# EAGLE design Testplatine_01_wiebeauftragt (EAGLE 6.5.0)
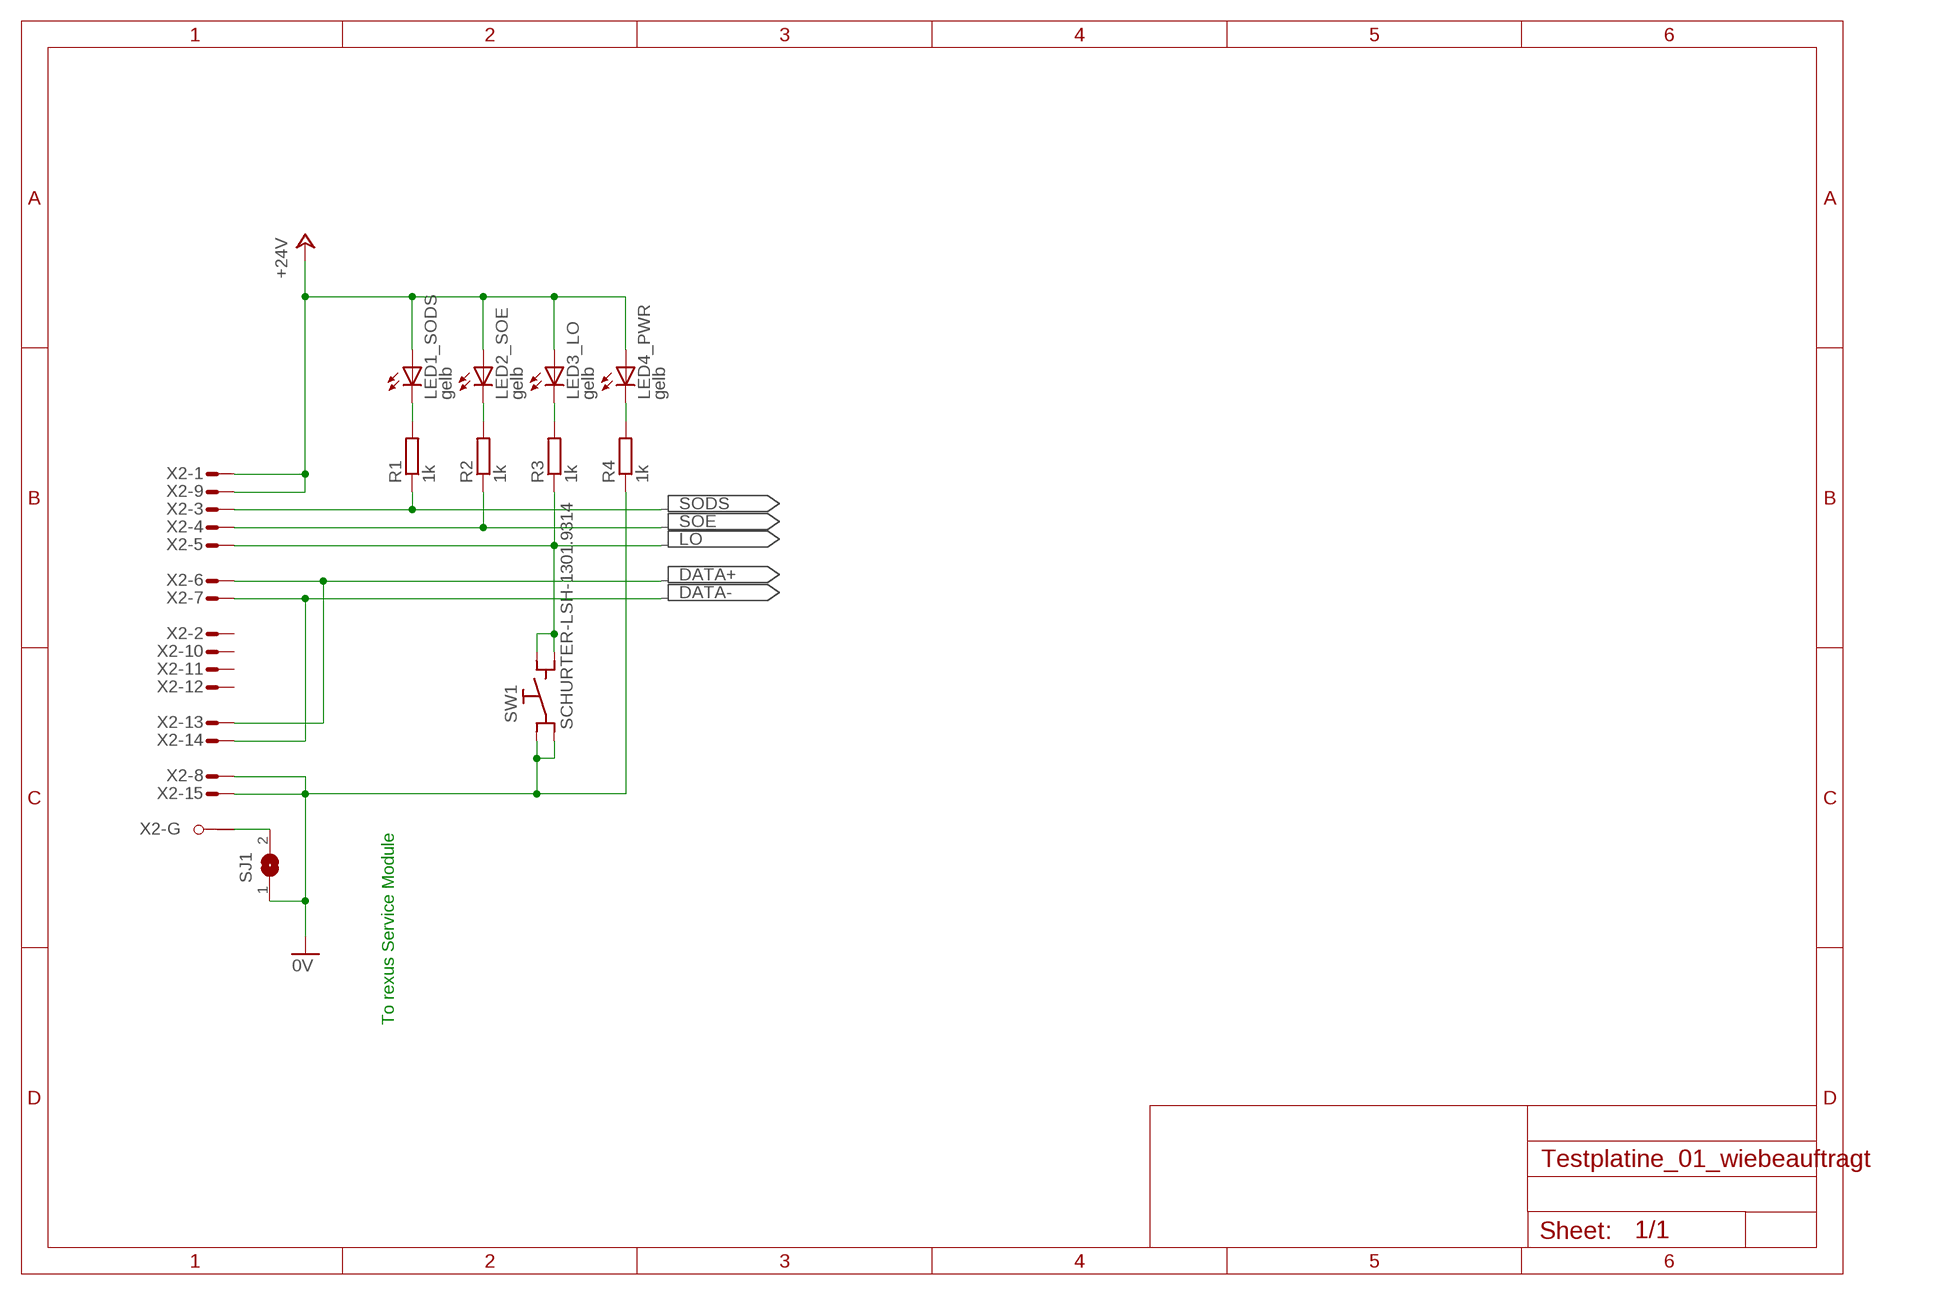
[diagram p0: schematic, sheet 1]

## Parts
LED1_SODS  gelb  LEDCHIPLED_0805  [CHIPLED_0805]
LED2_SOE  gelb  LEDCHIPLED_0805  [CHIPLED_0805]
LED3_LO  gelb  LEDCHIPLED_0805  [CHIPLED_0805]
LED4_PWR  gelb  LEDCHIPLED_0805  [CHIPLED_0805]
R1  1k  R-EU_R0805  [R0805]
R2  1k  R-EU_R0805  [R0805]
R3  1k  R-EU_R0805  [R0805]
R4  1k  R-EU_R0805  [R0805]
SJ1  SJ  [SJ]
SW1  SCHURTER-LSH-1301.9314  [LSH]
X2  M15HPS  [M15HP]

## Nets
0V: R4.1 SJ1.1 SW1.C1(C) SW1.C2(C) X2.8(-8:M) X2.15(-15:M)
+24V: LED1_SODS.A LED2_SOE.A LED3_LO.A LED4_PWR.A X2.1(-1:M) X2.9(-9:M)
DATA+: X2.6(-6:M) X2.13(-13:M)
DATA-: X2.7(-7:M) X2.14(-14:M)
LO: R3.1 SW1.NO1(NO) SW1.NO2(NO) X2.5(-5:M)
N$1: LED1_SODS.C R1.2
N$2: LED2_SOE.C R2.2
N$3: LED3_LO.C R3.2
N$4: LED4_PWR.C R4.2
N$6: SJ1.2 X2.G1(-G:G1)
SODS: R1.1 X2.3(-3:M)
SOE: R2.1 X2.4(-4:M)
Unconnected: X2.2(-2:M) X2.10(-10:M) X2.11(-11:M) X2.12(-12:M) X2.G2(-G:G2)

## Notes on the sheet
- To rexus Service Module

## Library data of the parts
LED1_SODS LED2_SOE LED3_LO LED4_PWR = led:LED: LED OSRAM: - CHIPLED LG R971, LG N971, LY N971, LG Q971, LY Q971, LO R971, LY R971 LH N974, LH R974 LS Q976, LO Q976, LY Q976 LO Q996 - Hyper CHIPLED LW Q18S LB Q993, LB Q99A, LB R99A - SideLED LS A670, LO A670, LY A670, LG A670, LP A670 LB A673, LV A673, LT A673, LW A673 LH A674 LY A675 LS A676, LA A676, LO A676, LY A676, LW A676 LS A679, LY A679, LG A679 - Hyper Micro SIDELED® LS Y876, LA Y876, LO Y876, LY Y876 LT Y87S - SmartLED LW L88C, LW L88S LB L89C, LB L89S, LG L890 LS L89K, LO L89K, LY L89K LS L896, LA L896, LO L896, LY L896 - TOPLED LS T670, LO T670, LY T670, LG T670, LP T670 LSG T670, LSP T670, LSY T670, LOP T670, LYG T670 LG T671, LOG T671, LSG T671 LB T673, LV T673, LT T673, LW T673 LH T674 LS T676, LA T676, LO T676, LY T676, LB T676, LH T676, LSB T676, LW T676 LB T67C, LV T67C, LT T67C, LS T67K, LO T67K, LY T67K, LW E67C LS E67B, LA E67B, LO E67B, LY E67B, LB E67C, LV E67C, LT E67C LW T67C LS T679, LY T679, LG T679 LS T770, LO T770, LY T770, LG T770, LP T770 LB T773, LV T773, LT T773, LW T773 LH T774 LS E675, LA E675, LY E675, LS T675 LS T776, LA T776, LO T776, LY T776, LB T776 LHGB T686 LT T68C, LB T68C - Hyper Mini TOPLED® LB M676 - Mini TOPLED Santana® LG M470 LS M47K, LO M47K, LY M47K Source: http://www.osram.convergy.de LUXEON: - LUMILED® LXK2-PW12-R00, LXK2-PW12-S00, LXK2-PW14-U00, LXK2-PW14-V00 LXK2-PM12-R00, LXK2-PM12-S00, LXK2-PM14-U00 LXK2-PE12-Q00, LXK2-PE12-R00, LXK2-PE12-S00, LXK2-PE14-T00, LXK2-PE14-U00 LXK2-PB12-K00, LXK2-PB12-L00, LXK2-PB12-M00, LXK2-PB14-N00, LXK2-PB14-P00, LXK2-PB14-Q00 LXK2-PR12-L00, LXK2-PR12-M00, LXK2-PR14-Q00, LXK2-PR14-R00 LXK2-PD12-Q00, LXK2-PD12-R00, LXK2-PD12-S00 LXK2-PH12-R00, LXK2-PH12-S00 LXK2-PL12-P00, LXK2-PL12-Q00, LXK2-PL12-R00 Source: www.luxeon.com KINGBRIGHT: KA-3528ASYC Source: www.kingbright.com; OC_FARNELL: 2099242
R1-R4 = rcl:R-EU_: RESISTOR, European symbol; OC_FARNELL: 1887280
SJ1 = jumper:SJ: SMD solder JUMPER
SW1 = schurter_LPH_LPS_LSH_SMS:SCHURTER-LSH-*: Schurter LSH Printmount Switches, Gullwing Leads [SMT] Momentary Action: Normally Open (NO) (6.0 x 6.0)mm Body Dim. Note: using same package drawing for actuator diam. (3.00 … 3.40)mm Source: www.schurter.com Actuator Diam. mm / Overall Height mm / Schurter # -------------------------------------------------------------- 3.40 / 04.30 / 1301.9314.xx 3.40 / 05.00 / 1301.9315.xx 3.20 / 07.00 / 1301.9316.xx 3.30 / 07.30 / 1301.9317.xx 3.10 / 08.00 / 1301.9319.xx 3.00 / 12.50 / 1301.9320.xx xx: denotes packaging, see Schurter data sheets Author: Dipl.-Ing. FH Rainer Bayer Hochschule Heilbronn HHN: rainer.bayer@hs-heilbronn.de − http://www.hs-heilbronn.de/rainer.bayer Ingenieurbüro ing-rb: mail@ing-rb.de − http://www.ing-rb.de/; OC_FARNELL: 1217763
X2 = con-subd:M15HPS: SUB-D; OC_FARNELL: 1097065 + 2x 1855027; OC_NEWARK: unknown; OC_RS: 692-7976 + 2x 719-9753

## Board
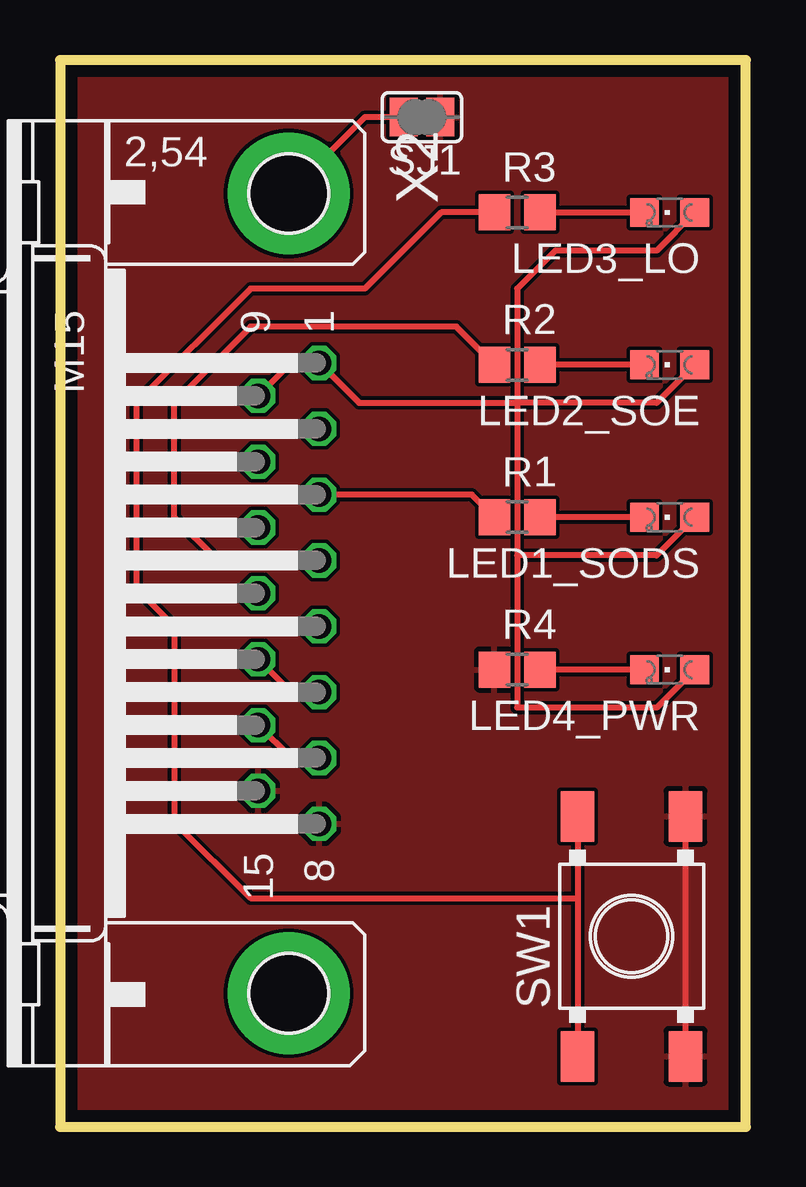
[diagram p1: board, top side]
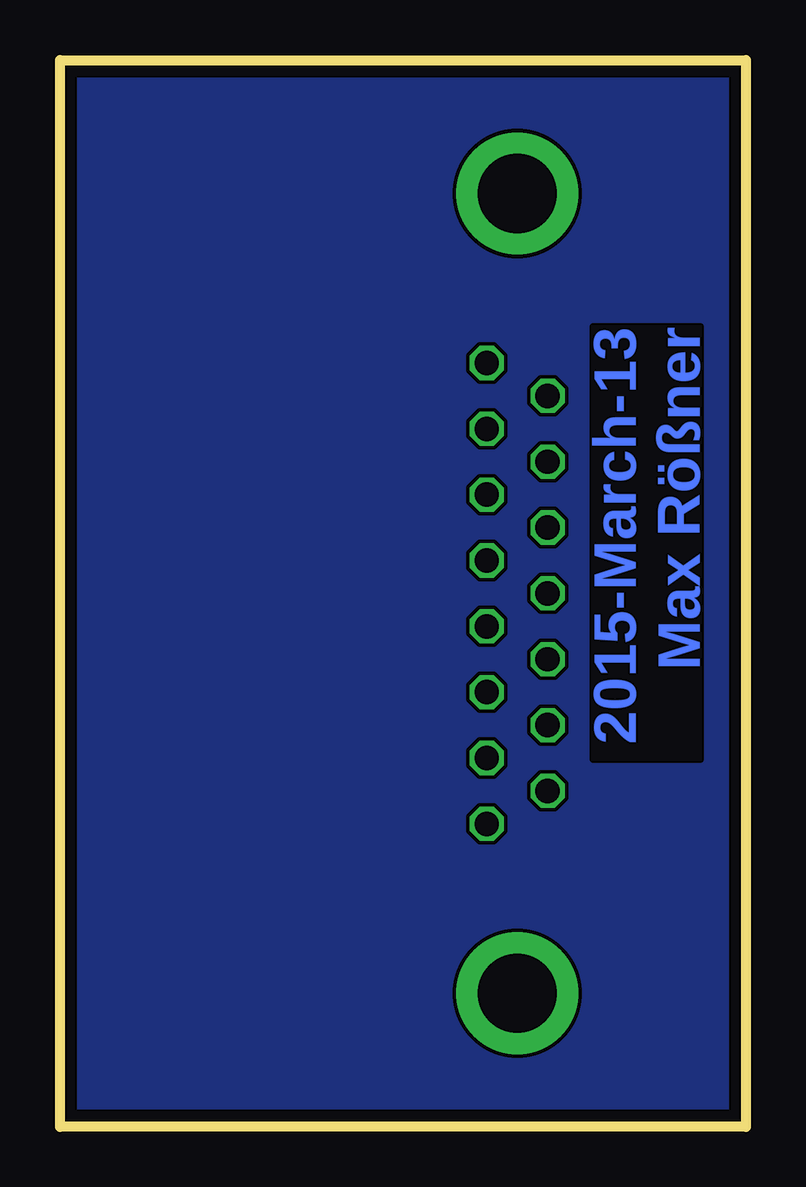
[diagram p2: board, bottom side, seen from below]

Size 28.57 x 44.45 mm. Coordinates in mm from the lower left corner, seen from the top.
Outline: 0,0 28.57,0 28.57,44.45 0,44.45 0,0
Copper layers (1*16): Top 0.035mm / dielectric 1.5mm / Bottom 0.035mm
Design rules "multi-cb_035um-cu *": minimum track width 6mil, minimum drill 12mil, track to track 6mil, track to pad 6mil, pad to pad 6mil, via to via 6mil, smd to smd 6mil, copper to edge 20mil, drill to drill 8mil, minimum pad ring 8mil, minimum via ring 6mil, stop-mask expansion 3mil, vias tented up to drill 0mil, thermal gap 8mil

### Footprints (pad centres in the part's own frame; a part is rotated, then mirrored left to right if it is on the bottom)
CHIPLED_0805 = smd 1.2 x 1.2: A 0,-1.05; C 0,1.05
R0805 = smd 1.3 x 1.5: 1 -0.95,0; 2 0.95,0
SJ = smd 1.168 x 1.6: 1 -0.762,0; 2 0.762,0
LSH = smd 2.1 x 1.4: C1 -5,-2.25; C2 5,-2.25; NO1 -5,2.25; NO2 5,2.25
M15HP = drill 1.016 octagon: 1 -9.601,1.27; 2 -6.858,1.27; 3 -4.115,1.27; 4 -1.372,1.27; 5 1.372,1.27; 6 4.115,1.27; 7 6.858,1.27; 8 9.601,1.27; 9 -8.23,-1.27; 10 -5.486,-1.27; 11 -2.743,-1.27; 12 0,-1.27; 13 2.743,-1.27; 14 5.486,-1.27; 15 8.23,-1.27 | drill 3.302 pad 5.08: G1 -16.662,0; G2 16.662,0

### Placement (x,y rotation side)
LED1_SODS  25.4,25.4 90 top
LED2_SOE  25.4,31.75 90 top
LED3_LO  25.4,38.1 90 top
LED4_PWR  25.4,19.05 90 top
R1  19.05,25.4 0 top
R2  19.05,31.75 0 top
R3  19.05,38.1 0 top
R4  19.05,19.05 0 top
SJ1  15.08,42.07 180 top
SW1  23.81,7.94 90 top
X2  9.53,22.23 270 top

### Tracks (layer width: path | path; a pad name or v marks a point on that pad's centre or on a via)
0V
  Top 0.254: SW1.C1 SW1.C2
  Top 0.406: SW1.C2 26.06,13.62
  pour Top: -1.59,46.04 30.16,46.04 30.16,-1.59 -1.59,-1.59
+24V
  Top 0.254: X2.9 9.63,31.83 X2.1 12.46,30.16 19.05,30.16 | LED3_LO.A 24.86,36.51 20.64,36.51 19.05,34.92 19.05,30.16 | LED2_SOE.A 24.86,30.16 19.05,30.16 | LED1_SODS.A 24.86,23.81 19.05,23.81 | LED4_PWR.A 24.86,17.46 19.05,17.46 19.05,23.81 | 19.05,30.16 19.05,23.81
DATA+
  Top 0.254: X2.6 9.63,18.11 X2.13
DATA-
  Top 0.254: X2.7 9.63,15.37 X2.14
LO
  Top 0.254: R3.1 15.88,38.1 12.7,34.92 7.94,34.92 3.17,30.16 3.17,22.44 4.76,20.85 | 4.76,20.85 4.76,12.7 7.94,9.53 21.56,9.53 | X2.5 4.76,20.85 | SW1.NO2 21.56,9.53 | 21.56,9.53 SW1.NO1
N$1
  Top 0.254: LED1_SODS.C R1.2
N$2
  Top 0.254: LED2_SOE.C R2.2
N$3
  Top 0.254: R3.2 LED3_LO.C
N$4
  Top 0.254: LED4_PWR.C R4.2
N$5
  pour Bottom: 0,44.45 28.57,44.45 28.57,0 0,0
N$6
  Top 0.254: SJ1.2 12.71,42.07 X2.G1
SODS
  Top 0.254: R1.1 17.16,26.34 X2.3
SOE
  Top 0.254: R2.1 16.51,33.34 7.94,33.34 4.76,30.16 4.76,25.4 6.57,23.6 X2.4

### Text on the board
Bottom: 2015-March-13 / Max Rößner
tStop: LO | SOE | SODS | Pwr | LO